# EAGLE design PCB (EAGLE 8.2.1)
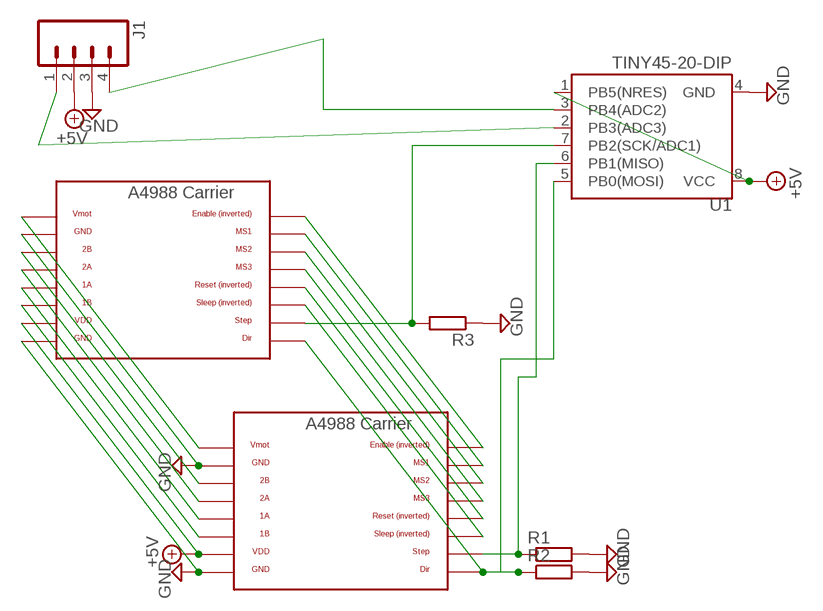
[diagram p0: schematic, sheet 1]

## Parts
J1  M04JST-PTH-VERT  [JST-4-PTH-VERT]
R1  R-EU_R0805  [R0805]
R2  R-EU_R0805  [R0805]
R3  R-EU_R0805  [R0805]
U1  TINY45-20-DIP  ATTINY45TINY45-20-DIP  [DIP08]
U$1  A4988BREAKOUT  [A4988BREAKOUT]
U$2  A4988BREAKOUT  [A4988BREAKOUT]

## Nets
+5V: J1.2 U1.1(PB5(NRES)) U1.8(VCC) U$1.VDD U$2.VDD
GND: J1.3 R1.2 R2.2 R3.1 U1.4(GND) U$1.GND U$1.GND@0(GND) U$2.GND U$2.GND@0(GND)
N$1: U$1.EN U$2.EN
N$2: U$1.MS1 U$2.MS1
N$3: U$1.MS2 U$2.MS2
N$4: U$1.MS3 U$2.MS3
N$5: U$1.RST U$2.RST
N$6: U$1.SLP(SLEEP) U$2.SLP(SLEEP)
N$7: R1.1 U1.6(PB1(MISO)) U$2.STEP
N$8: R2.1 U1.5(PB0(MOSI)) U$1.DIR U$2.DIR
N$9: R3.2 U1.7(PB2(SCK/ADC1)) U$1.STEP
N$10: J1.4 U1.3(PB4(ADC2))
N$11: U$1.1B U$2.1B
N$12: U$1.1A U$2.1A
N$13: U$1.2A U$2.2A
N$14: U$1.2B U$2.2B
N$15: J1.1 U1.2(PB3(ADC3))
N$16: U$1.VMOT U$2.VMOT

## Library data of the parts
J1 = SparkFun-Connectors:M04: Header 4 Standard 4-pin 0.1" header. Use with straight break away headers (SKU : PRT-00116), right angle break away headers (PRT-00553), swiss pins (PRT-00743), machine pins (PRT-00117), and female headers (PRT-00115). Molex polarized connector foot print use with SKU : PRT-08231 with associated crimp pins and housings. 1MM SMD Version SKU: PRT-10208; PROD_ID: CONN-13251
R1-R3 = rcl:R-EU_: RESISTOR, European symbol
U1 = SparkFun-DigitalIC:ATTINY45: Atmel 8-pin 2/4/8kB flash uC; PROD_ID: IC-09439
U$1 U$2 = RepRapjr:A4988BREAKOUT

## Board
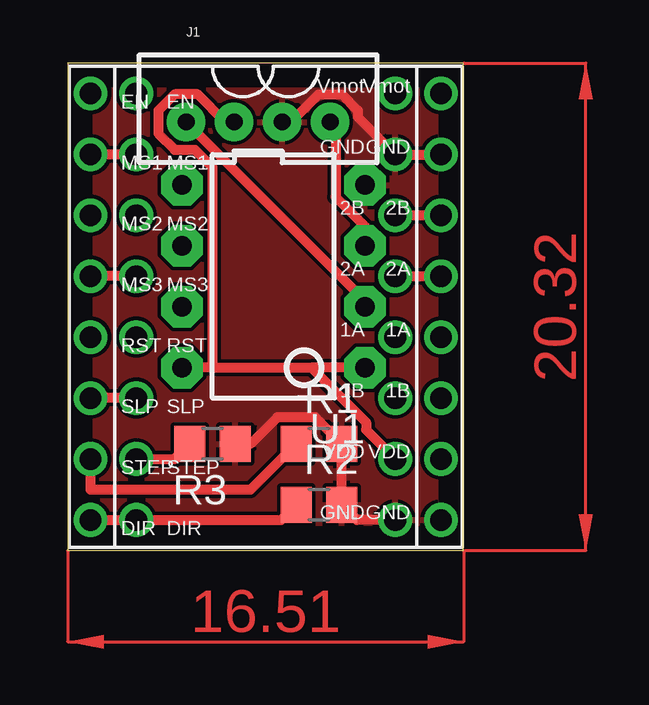
[diagram p1: board, top side]
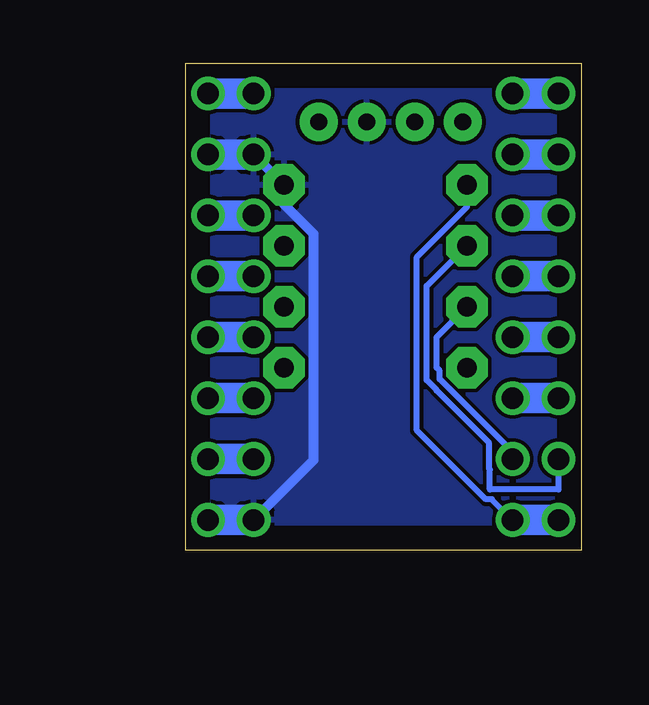
[diagram p2: board, bottom side, seen from below]

Size 16.49 x 20.31 mm. Coordinates in mm from the lower left corner, seen from the top.
Outline: 0,0 16.49,0 16.49,20.31 0,20.31 0,0
Copper layers (1*16): Top 0.035mm / dielectric 1.5mm / Bottom 0.035mm
Design rules "default": minimum track width 6mil, minimum drill 0.35mm, track to track 6mil, track to pad 6mil, pad to pad 6mil, via to via 6mil, smd to smd 6mil, copper to edge 40mil, drill to drill 6mil, minimum pad ring 10mil, minimum via ring 8mil, stop-mask expansion 4mil, vias tented up to drill 0mil, thermal gap 10mil

### Footprints (pad centres in the part's own frame; a part is rotated, then mirrored left to right if it is on the bottom)
JST-4-PTH-VERT = drill 0.7 pad 1.6: 1 -3,-0.55; 2 -1,-0.55; 3 1,-0.55; 4 3,-0.55
R0805 = smd 1.3 x 1.5: 1 -0.95,0; 2 0.95,0
DIP08 = drill 0.813 pad 1.727 octagon: 1 -3.81,-3.81; 2 -1.27,-3.81; 3 1.27,-3.81; 4 3.81,-3.81; 5 3.81,3.81; 6 1.27,3.81; 7 -1.27,3.81; 8 -3.81,3.81
A4988BREAKOUT = drill 0.9: 1A 8.89,1.27; 1B 11.43,1.27; 2A 6.35,1.27; 2B 3.81,1.27; DIR 16.51,-11.43; EN -1.27,-11.43; GND 16.51,1.27; GND@0 1.27,1.27; MS1 1.27,-11.43; MS2 3.81,-11.43; MS3 6.35,-11.43; RST 8.89,-11.43; SLP 11.43,-11.43; STEP 13.97,-11.43; VDD 13.97,1.27; VMOT -1.27,1.27

### Placement (x,y rotation side)
J1  7.94,18.41 0 top
R1  10.48,4.45 0 top
R2  10.48,1.91 0 top
R3  6.03,4.45 180 top
U1  8.57,11.43 90 top
U$1  14.29,17.78 270 top
U$2  12.38,17.78 270 top

### Tracks (layer width: path | path; a pad name or v marks a point on that pad's centre or on a via)
+5V
  Top 0.406: U$2.VDD 12.43,5.03 12.43,5.34 10.16,7.62 | 6.03,7.62 10.16,7.62 | 6.03,7.62 U1.8 | U1.1 10.16,7.62 | J1.2 6.57,17.86 5.42,19.02 4.46,19.02 3.78,18.34 3.78,17.39 4.46,16.71 5.3,16.71 6.03,15.98 6.03,7.62
  Bottom 1.27: U$1.VDD U$2.VDD
GND
  Top 0.406: U$1.GND@0 U$2.GND@0 12.09,18.07 12.09,18.34 11.42,19.02 10.46,19.02 9.3,17.86 J1.3 | U$2.GND 12.06,1.27 R2.2 R1.2 10.53,5.34 10.32,5.55 8.73,5.55 7.62,4.45 R3.1
  Bottom 0.406: U$2.GND@0 U1.4 12.38,14.42 11.16,13.21 11.16,3.76 U$2.GND
  Bottom 1.27: U$1.GND U$2.GND | U$1.GND@0 U$2.GND@0
  pour Top: 0,20.32 0,0 16.51,0 16.51,20.32
  pour Bottom: 0,20.32 16.51,20.32 16.51,0 0,0
N$1
  Bottom 1.27: U$1.EN U$2.EN
N$2
  Top 0.406: U$1.MS1 1.54,16.51
  Bottom 1.27: U$2.MS1 U$1.MS1
N$3
  Bottom 1.27: U$2.MS2 U$1.MS2
N$4
  Top 0.406: U$1.MS3 1.54,11.43
  Bottom 1.27: U$2.MS3 U$1.MS3
N$5
  Bottom 1.27: U$2.RST U$1.RST
N$6
  Top 0.406: U$1.SLP 1.54,6.35
  Bottom 1.27: U$2.SLP U$1.SLP
N$7
  Top 0.406: U$2.STEP 0.95,2.54 7.62,2.54 R1.1
  Bottom 0.254: U$2.STEP 0.95,2.54 3.81,2.54 3.81,3.37 3.84,3.4 3.84,4.48 6.03,6.67 6.03,6.7 6.44,7.11 6.44,11.02 U1.6
N$8
  Top 0.406: 1.54,1.27 U$1.DIR 8.89,1.27 R2.1
  Bottom 0.254: U$1.DIR 3.72,2.13 3.98,2.13 6.85,5 6.85,12.23 4.76,14.32 U1.5
  Bottom 1.27: U$2.DIR U$1.DIR
N$9
  Top 0.406: U$1.STEP 4.45,3.81 R3.2
  Bottom 0.254: U$1.STEP 2.86,4.1 5.91,7.15 5.91,7.49 6.03,7.62 6.03,8.89 U1.7
N$10
  Top 0.254: 11.11,15.56 11.24,15.43 11.24,14.77 12.38,13.62 U1.3
  Top 0.406: U1.3 12.38,13.52 11.16,14.73 11.16,17.64 J1.4
N$11
  Bottom 1.27: U$1.1B U$2.1B
N$12
  Bottom 1.27: U$1.1A U$2.1A
N$13
  Top 0.406: U$2.2A U$1.2A
  Bottom 1.27: U$1.2A U$2.2A
N$14
  Top 0.406: U$1.2B U$2.2B
  Bottom 0.61: 14.84,13.97 15.17,13.97
  Bottom 1.27: 14.29,13.97 U$2.2B | 14.29,13.97 14.84,13.97 | U$1.2B 14.29,13.97
N$15
  Top 0.406: J1.1 12.38,10.42 U1.2
N$16
  Bottom 1.27: U$2.VMOT U$1.VMOT
N$17
  pour Top: 0,20.32 0,0 16.51,0 16.51,20.32
N$18
  pour Bottom: 0,20.32 16.51,20.32 16.51,0 0,0
(copper drawn outside any net)
  shapes: Top area x2